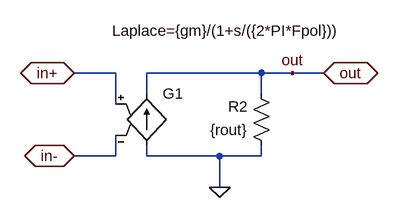
[diagram p0: schematic Gm_model.asc]
Gm_model.asc, the LTspice schematic file:
Version 4
SHEET 1 2564 1736
WIRE 1248 208 1184 208
WIRE 1472 208 1296 208
WIRE 1520 208 1472 208
WIRE 1568 208 1520 208
WIRE 1296 240 1296 208
WIRE 1472 240 1472 208
WIRE 1248 256 1248 208
WIRE 1248 336 1248 304
WIRE 1248 336 1184 336
WIRE 1296 336 1296 320
WIRE 1408 336 1296 336
WIRE 1472 336 1472 320
WIRE 1472 336 1408 336
WIRE 1408 384 1408 336
FLAG 1520 208 out
FLAG 1568 208 out
IOPIN 1568 208 BiDir
FLAG 1184 208 in+
IOPIN 1184 208 BiDir
FLAG 1184 336 in-
IOPIN 1184 336 BiDir
FLAG 1408 384 0
SYMBOL g 1296 224 R0
WINDOW 3 -53 -81 Left 2
SYMATTR Value Laplace={gm}/(1+s/({2*PI*Fpol}))
SYMATTR InstName G1
SYMBOL res 1488 336 R180
WINDOW 0 36 76 Left 2
WINDOW 3 36 40 Left 2
SYMATTR InstName R2
SYMATTR Value {rout}

The netlist it stands for:
* Gm_model.asc
G1 0 out in+ in- Laplace={gm}/(1+s/({2*PI*Fpol}))
R2 0 out {rout}
.backanno
.end